# EAGLE design HeadBoard (EAGLE 9.6.2)
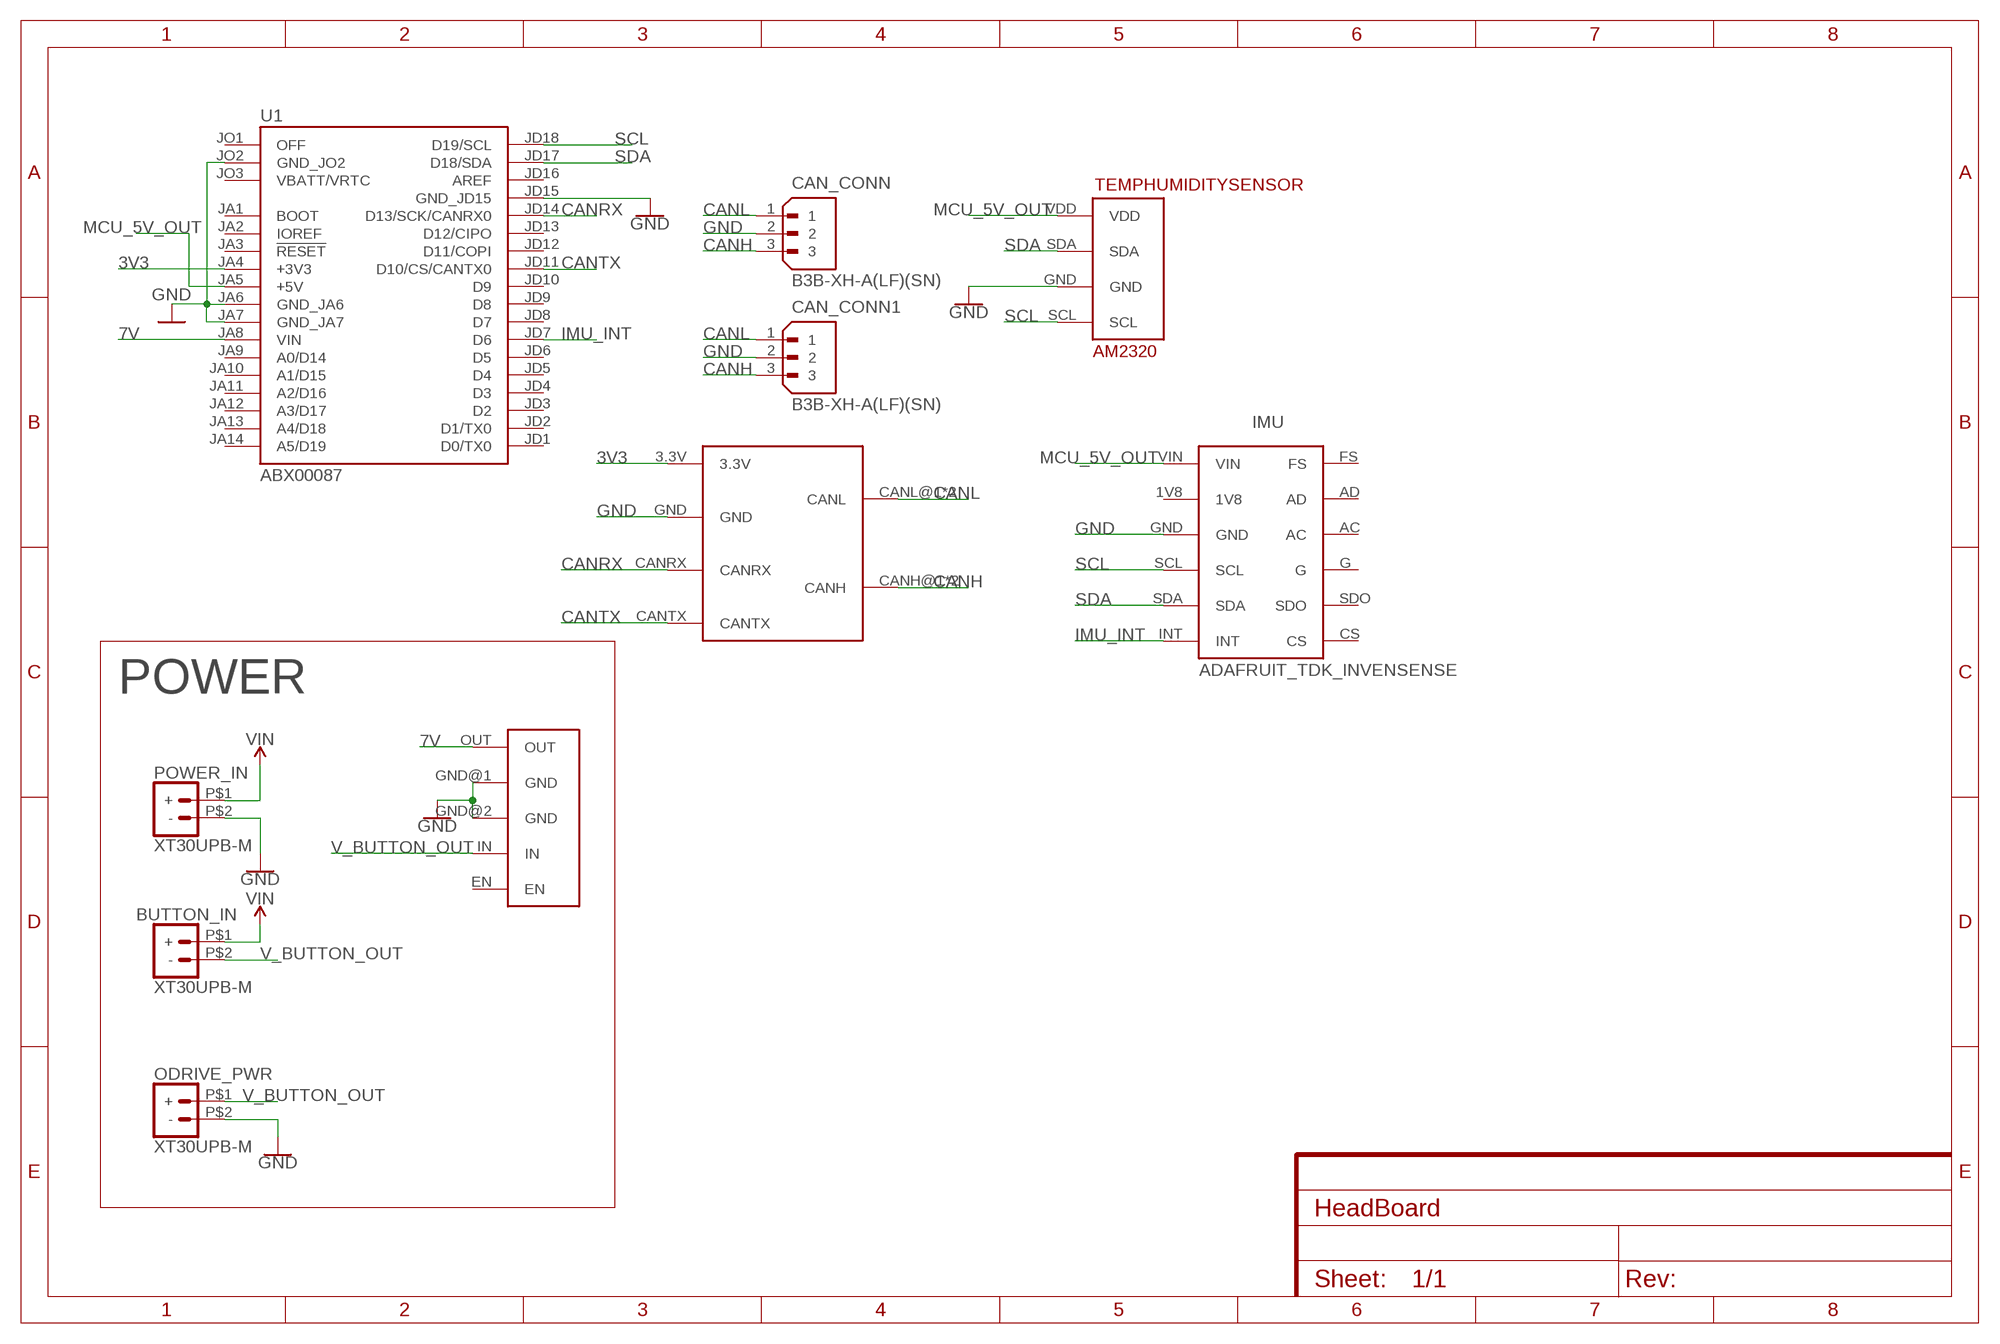
[diagram p0: schematic, sheet 1]

## Parts
BUTTON_IN  XT30UPB-M  [XT30UPB-M]
CAN_CONN  B3B-XH-A(LF)(SN)  [JST_B3B-XH-A(LF)(SN)]
CAN_CONN1  B3B-XH-A(LF)(SN)  [JST_B3B-XH-A(LF)(SN)]
IMU  ADAFRUIT_TDK_INVENSENSE  [ADAFRUIT_TDK_INVENSENSE]
ODRIVE_PWR  XT30UPB-M  [XT30UPB-M]
POWER_IN  XT30UPB-M  [XT30UPB-M]
TEMPHUMIDITYSENSOR  AM2320  [AM2320]
U1  ABX00087  [MODULE_ABX00087]
U$1  D36V28F7  [D36V28F5]
U$2  WAVESHARE_SN65HVD230  [WAVESHARE_SN65HVD230]

## Nets
3V3: U1.JA4(+3V3) U$2.3.3V
7V: U1.JA8(VIN) U$1.OUT
CANH: CAN_CONN1.3 CAN_CONN.3 U$2.CANH@1(CANH) U$2.CANH@2(CANH)
CANL: CAN_CONN1.1 CAN_CONN.1 U$2.CANL@1(CANL) U$2.CANL@2(CANL)
CANRX: U1.JD14(D13/SCK/CANRX0) U$2.CANRX
CANTX: U1.JD11(D10/CS/CANTX0) U$2.CANTX
GND: CAN_CONN1.2 CAN_CONN.2 IMU.GND ODRIVE_PWR.P$2(-) POWER_IN.P$2(-) TEMPHUMIDITYSENSOR.GND U1.JA6(GND_JA6) U1.JA7(GND_JA7) U1.JD15(GND_JD15) U1.JO2(GND_JO2) U$1.GND@1(GND) U$1.GND@2(GND) U$2.GND
IMU_INT: IMU.INT U1.JD7(D6)
MCU_5V_OUT: IMU.VIN TEMPHUMIDITYSENSOR.VDD U1.JA5(+5V)
SCL: IMU.SCL TEMPHUMIDITYSENSOR.SCL U1.JD18(D19/SCL)
SDA: IMU.SDA TEMPHUMIDITYSENSOR.SDA U1.JD17(D18/SDA)
V_BUTTON_OUT: BUTTON_IN.P$2(-) ODRIVE_PWR.P$1(+) U$1.IN
VIN: BUTTON_IN.P$1(+) POWER_IN.P$1(+)
Unconnected: IMU.1V8 IMU.AC IMU.AD IMU.CS IMU.FS IMU.G IMU.SDO U1.JA1(BOOT) U1.JA2(IOREF) U1.JA3(!RESET) U1.JA9(A0/D14) U1.JA10(A1/D15) U1.JA11(A2/D16) U1.JA12(A3/D17) U1.JA13(A4/D18) U1.JA14(A5/D19) U1.JD1(D0/TX0) U1.JD2(D1/TX0) U1.JD3(D2) U1.JD4(D3) U1.JD5(D4) U1.JD6(D5) U1.JD8(D7) U1.JD9(D8) U1.JD10(D9) U1.JD12(D11/COPI) U1.JD13(D12/CIPO) U1.JD16(AREF) U1.JO1(OFF) U$1.EN

## Notes on the sheet
- POWER

## Power pins joined to a net without a drawn wire
VBATT/VRTC: U1.JO3(VBATT/VRTC)

## Library data of the parts
BUTTON_IN ODRIVE_PWR POWER_IN = XT30UPB-M:XT30UPB-M: Check availability <https://pricing.snapeda.com/parts/XT30UPB-M/amass/view-part?ref=eda>; AVAILABILITY: Not in stock; CHECK_PRICES: https://www.snapeda.com/parts/XT30UPB-M/AMASS/view-part/?ref=eda; DESCRIPTION: Socket; DC supply; XT30; male; PIN: 2; on PCBs; THT; yellow; 15A; 500V; MF: amass; MP: XT30UPB-M; PACKAGE: None; PRICE: None; SNAPEDA_LINK: https://www.snapeda.com/parts/XT30UPB-M/AMASS/view-part/?ref=snap
CAN_CONN CAN_CONN1 = B3B-XH-A_LF__SN_:B3B-XH-A(LF)(SN): Check availability <https://pricing.snapeda.com/parts/B3B-XH-A%28LF%29%28SN%29/JST%20Sales/view-part?ref=eda>; AVAILABILITY: In Stock; CHECK_PRICES: https://www.snapeda.com/parts/B3B-XH-A(LF)(SN)/JST+Sales+America+Inc./view-part/?ref=eda; DESCRIPTION: Connector Header Through Hole 3 position 0.098 (2.50mm); MF: JST Sales; MP: B3B-XH-A(LF)(SN); PACKAGE: None; PRICE: None; SNAPEDA_LINK: https://www.snapeda.com/parts/B3B-XH-A(LF)(SN)/JST+Sales+America+Inc./view-part/?ref=snap
IMU = UnderactuatedDorsalFin:ADAFRUIT_TDK_INVENSENSE
TEMPHUMIDITYSENSOR = UnderactuatedDorsalFin:AM2320
U1 = ABX00087:ABX00087; MANUFACTURER: Arduino; PARTREV: 4; STANDARD: Manufacturer Recommendations
U$1 = UnderactuatedDorsalFin:D36V28F7
U$2 = UnderactuatedDorsalFin:WAVESHARE_SN65HVD230

## Board
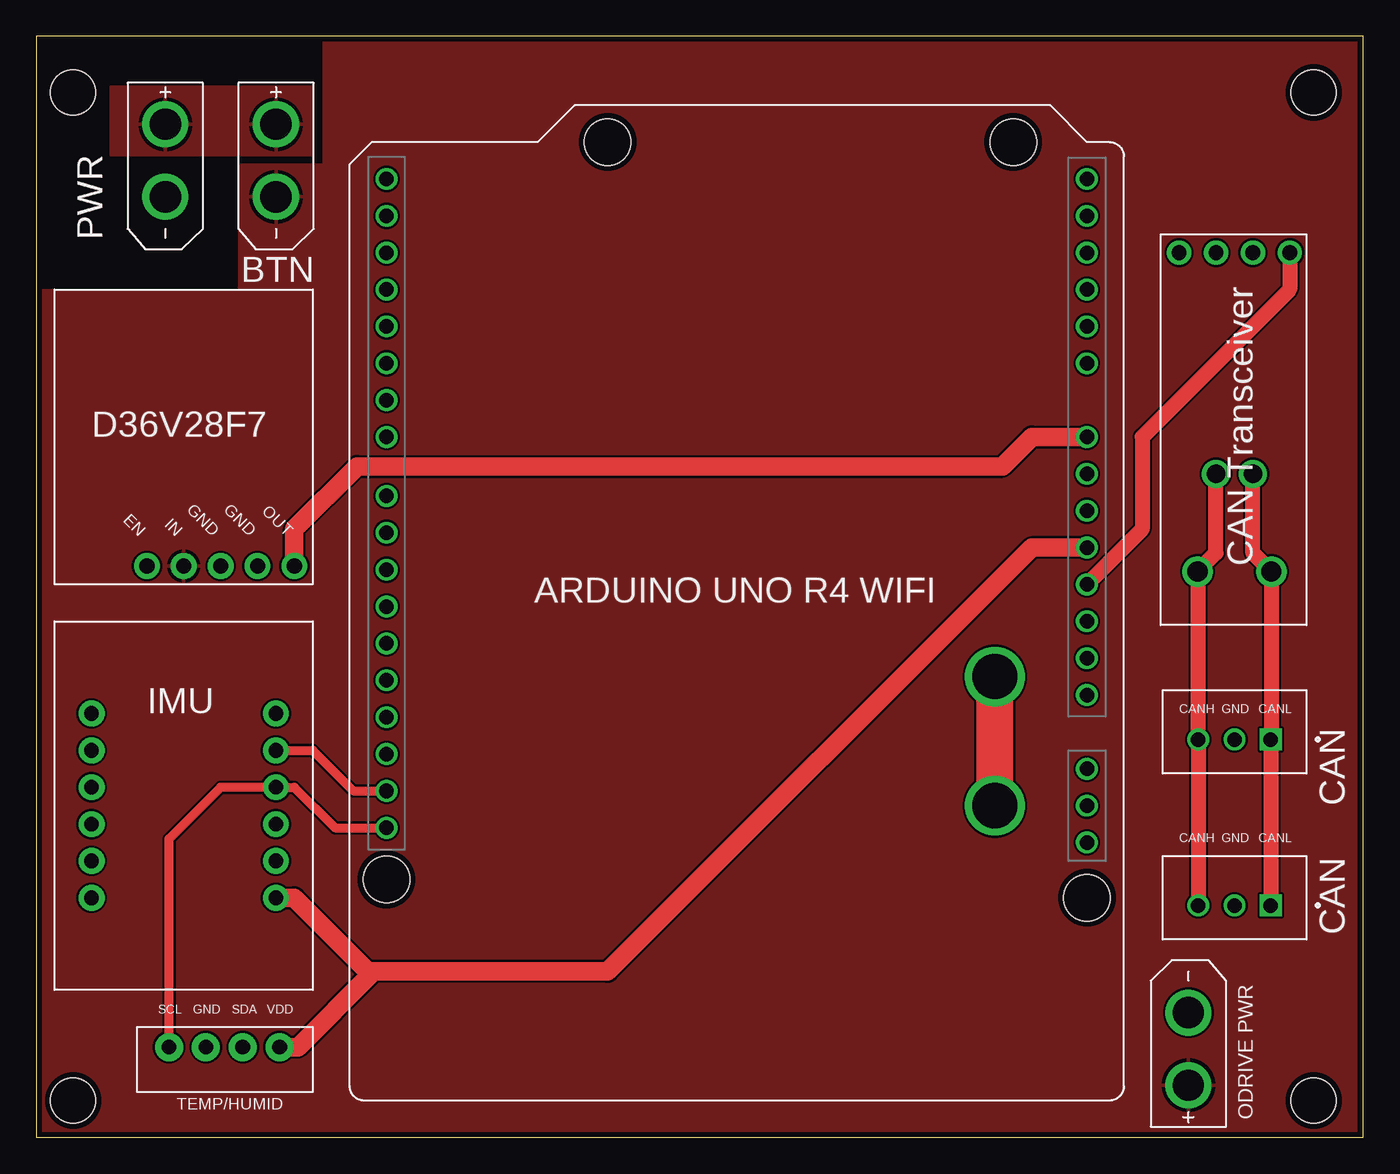
[diagram p1: board, top side]
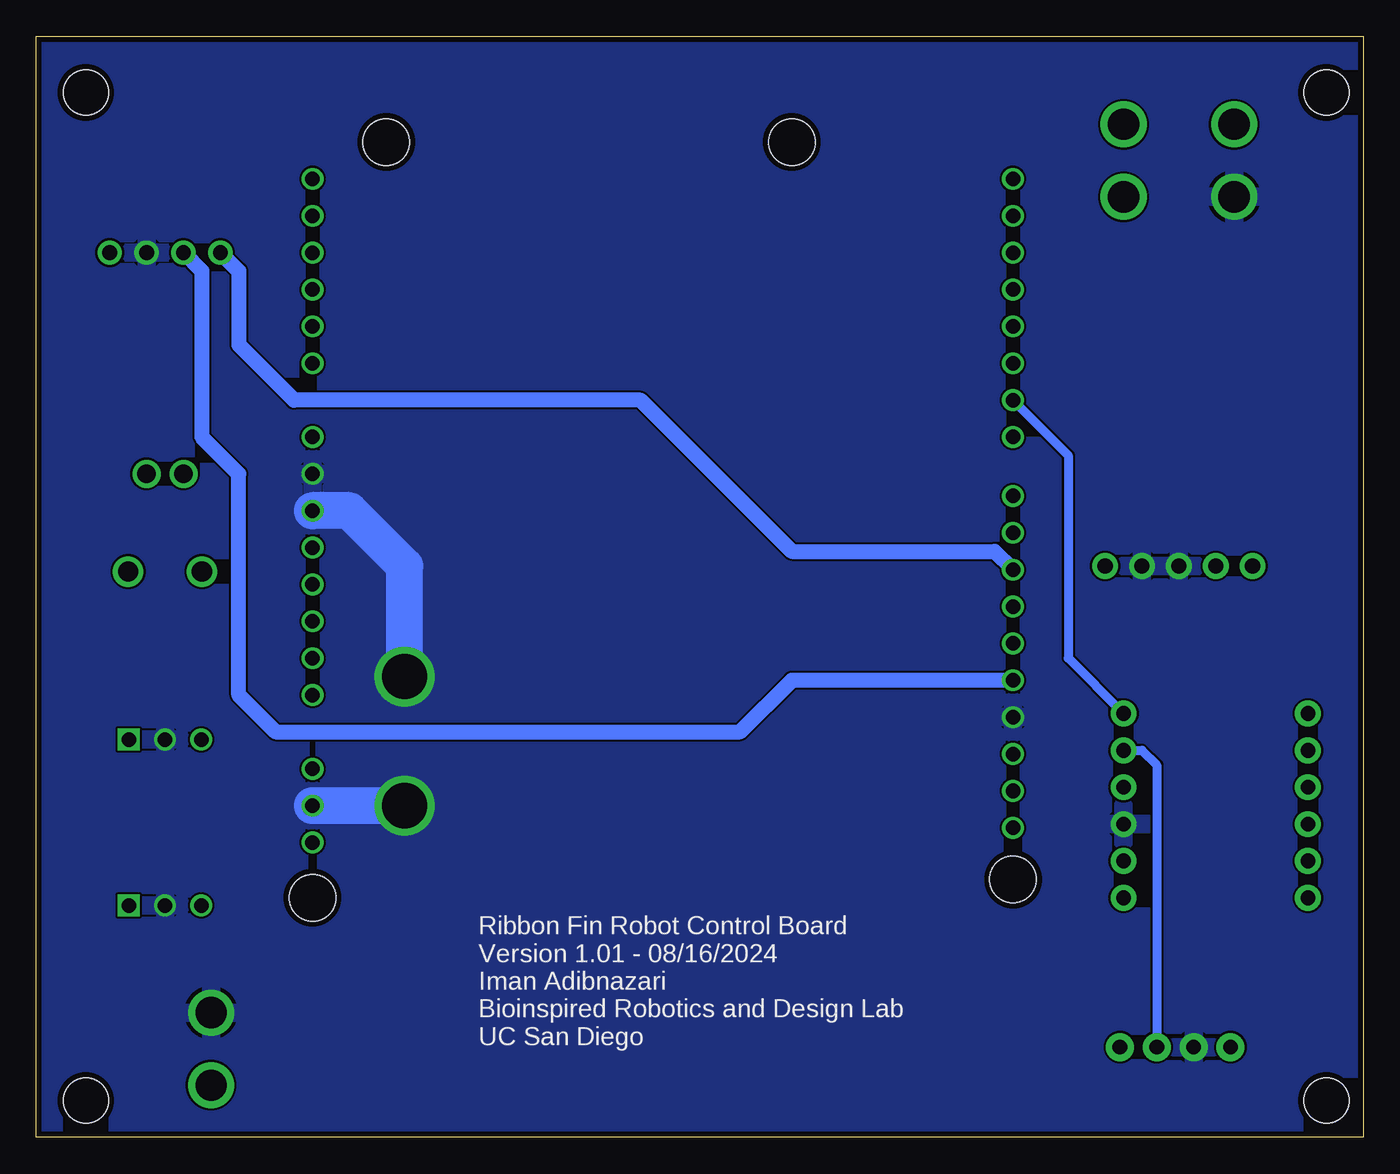
[diagram p2: board, bottom side, seen from below]

Size 91.42 x 75.87 mm. Coordinates in mm from the lower left corner, seen from the top.
Outline: 0,0 91.42,0 91.42,75.87 0,75.87 0,0
Copper layers (1*16): Top 0.035559375mm / dielectric 1.6mm / Bottom 0.035559375mm
Design rules "oshpark-2layer": minimum track width 6mil, minimum drill 10mil, track to track 6mil, track to pad 6mil, pad to pad 6mil, via to via 6mil, smd to smd 6mil, copper to edge 15mil, drill to drill 6mil, minimum pad ring 5mil, minimum via ring 5mil, stop-mask expansion 2.5mil, vias tented up to drill 0mil, thermal gap 10mil
Holes 3.1 mm at 88,72 88,2.54 2.54,2.54 2.54,72

### Footprints (pad centres in the part's own frame; a part is rotated, then mirrored left to right if it is on the bottom)
XT30UPB-M = drill 2.159: P$1 -2.5,0; P$2 2.5,0
JST_B3B-XH-A(LF)(SN) = drill 1 square: 1 2.5,-0.525 | drill 1: 2 0,-0.525; 3 -2.5,-0.525
ADAFRUIT_TDK_INVENSENSE = drill 1.016 pad 1.778: 1V8 -3.81,-6.35; AC -1.27,6.35; AD -3.81,6.35; CS 6.35,6.35; FS -6.35,6.35; G 1.27,6.35; GND -1.27,-6.35; INT 6.35,-6.35; SCL 1.27,-6.35; SDA 3.81,-6.35; SDO 3.81,6.35; VIN -6.35,-6.35
AM2320 = drill 1.016 pad 1.93: GND 7.366,1.397; SCL 9.906,1.397; SDA 4.826,1.397; VDD 2.286,1.397
MODULE_ABX00087 = drill 1: JA1 -6.35,-24.13; JA2 -3.81,-24.13; JA3 -1.27,-24.13; JA4 1.27,-24.13; JA5 3.81,-24.13; JA6 6.35,-24.13; JA7 8.89,-24.13; JA8 11.43,-24.13; JA9 16.51,-24.13; JA10 19.05,-24.13; JA11 21.59,-24.13; JA12 24.13,-24.13; JA13 26.67,-24.13; JA14 29.21,-24.13; JD1 29.21,24.13; JD2 26.67,24.13; JD3 24.13,24.13; JD4 21.59,24.13; JD5 19.05,24.13; JD6 16.51,24.13; JD7 13.97,24.13; JD8 11.43,24.13; JD9 7.366,24.13; JD10 4.826,24.13; JD11 2.286,24.13; JD12 -0.254,24.13; JD13 -2.794,24.13; JD14 -5.334,24.13; JD15 -7.874,24.13; JD16 -10.414,24.13; JD17 -12.954,24.13; JD18 -15.494,24.13; JO1 -16.51,-24.13; JO2 -13.97,-24.13; JO3 -11.43,-24.13 | hole 3.2: -20.32,-24.13; -19.05,24.13; 31.75,8.89; 31.75,-19.05
D36V28F5 = drill 1.041 pad 1.778: EN 1.27,11.43; GND@1 1.27,3.81; GND@2 1.27,6.35; IN 1.27,8.89; OUT 1.27,1.27
WAVESHARE_SN65HVD230 = drill 1.016 pad 1.676: 3.3V 1.27,8.89; CANRX 1.27,3.81; CANTX 1.27,1.27; GND 1.27,6.35 | drill 1.397: CANH@1 23.241,2.54; CANL@1 23.241,7.62 | drill 1.27 pad 1.93: CANH@2 16.51,3.81; CANL@2 16.51,6.35

### Placement (x,y rotation side)
BUTTON_IN  16.51,67.31 270 top
CAN_CONN  82.55,27.94 0 top
CAN_CONN1  82.55,16.51 0 top
IMU  10.16,22.86 90 top
ODRIVE_PWR  79.38,6.1 90 top
POWER_IN  8.89,67.31 270 top
TEMPHUMIDITYSENSOR  19.05,7.62 180 top
U1  48.26,36.83 90 top
U$1  19.05,38.1 90 top
U$2  77.47,62.23 270 top

### Tracks (layer width: path | path; a pad name or v marks a point on that pad's centre or on a via)
3V3
  Top 1.016: U1.JA4 76.2,41.91 76.2,48.26 86.36,58.42 U$2.3.3V
7V
  Top 1.27: U$1.OUT 17.78,41.91 22.1,46.23 66.55,46.23 68.58,48.26 U1.JA8
CANH
  Top 1.016: CAN_CONN1.3 CAN_CONN.3 80.01,27.45 U$2.CANH@1 81.28,40.26 U$2.CANH@2
CANL
  Top 1.016: CAN_CONN1.1 CAN_CONN.1 85.09,27.45 U$2.CANL@1 83.82,40.26 U$2.CANL@2
CANRX
  Bottom 1.016: U1.JD14 39.37,31.5 42.93,27.94 74.93,27.94 77.47,30.48 77.47,45.72 80.01,48.26 80.01,59.69 U$2.CANRX
CANTX
  Bottom 1.016: U1.JD11 25.4,40.39 39.37,40.39 49.78,50.8 73.66,50.8 77.47,54.61 77.47,59.69 U$2.CANTX
GND  (via drill 3.1)
  Top 2.54: v66.04,22.86 v66.04,31.75
  Bottom 2.54: U1.JO2 v66.04,22.86 | v66.04,31.75 66.04,39.37 69.85,43.18 U1.JA6
  pour Bottom: 0,0 0,76.2 91.44,76.2 91.44,0
IMU_INT
  Bottom 0.61: U1.JD7 20.32,46.99 20.32,33.02 IMU.INT
MCU_5V_OUT
  Top 1.27: U1.JA5 68.58,40.64 39.37,11.43 23.24,11.43 23.05,11.24 | TEMPHUMIDITYSENSOR.VDD 18.03,6.22 23.05,11.24 | 23.05,11.24 17.78,16.51 IMU.VIN
SCL
  Top 0.61: U1.JD18 20.57,21.34 17.78,24.13 IMU.SCL 12.7,24.13 9.14,20.57 TEMPHUMIDITYSENSOR.SCL
SDA
  Top 0.61: IMU.SDA 19.05,26.67 21.84,23.88 U1.JD17
  Bottom 0.61: IMU.SDA 15.24,26.67 14.22,25.65 TEMPHUMIDITYSENSOR.SDA
V_BUTTON_OUT
  pour Top: 13.97,58.42 13.97,67.06 19.81,67.06 19.81,75.82 91.44,75.82 91.44,0 0,0 0,58.42
VIN
  pour Top: 5.08,72.39 5.08,67.69 19.05,67.69 19.05,72.39

### Text on the board
tPlace: PWR | BTN | D36V28F7 | CAN Transceiver | ARDUINO UNO R4 WIFI | IMU | CANH | GND | CANL | CAN | CANH | GND | CANL | CAN | ODRIVE PWR | SCL | GND | SDA | VDD | TEMP/HUMID
bPlace: Ribbon Fin Robot Control Board / Version 1.01 - 08/16/2024 / Iman Adibnazari / Bioinspired Robotics and Design Lab / UC San Diego